# Altium schematic sheet Standby_PS.SchDoc
size A1; SPICEModelCacheYQEDCYZF: <root> / <DocumentId>YQEDCYZF</DocumentId> / <CacheFrame Number="0"> / <Model Name="7850_744775147_47u" Kind="CKT"> / <Text>******* / .subckt 7850_744775147_47u 1 2 / Rp 1 2 40000 / Cp 1 2 4p / Rs 1 N3 0.1343 / L1 N3 2 47u / .ends 7850_744775147_47u</Text> / </Model> / </CacheFrame> / </root>
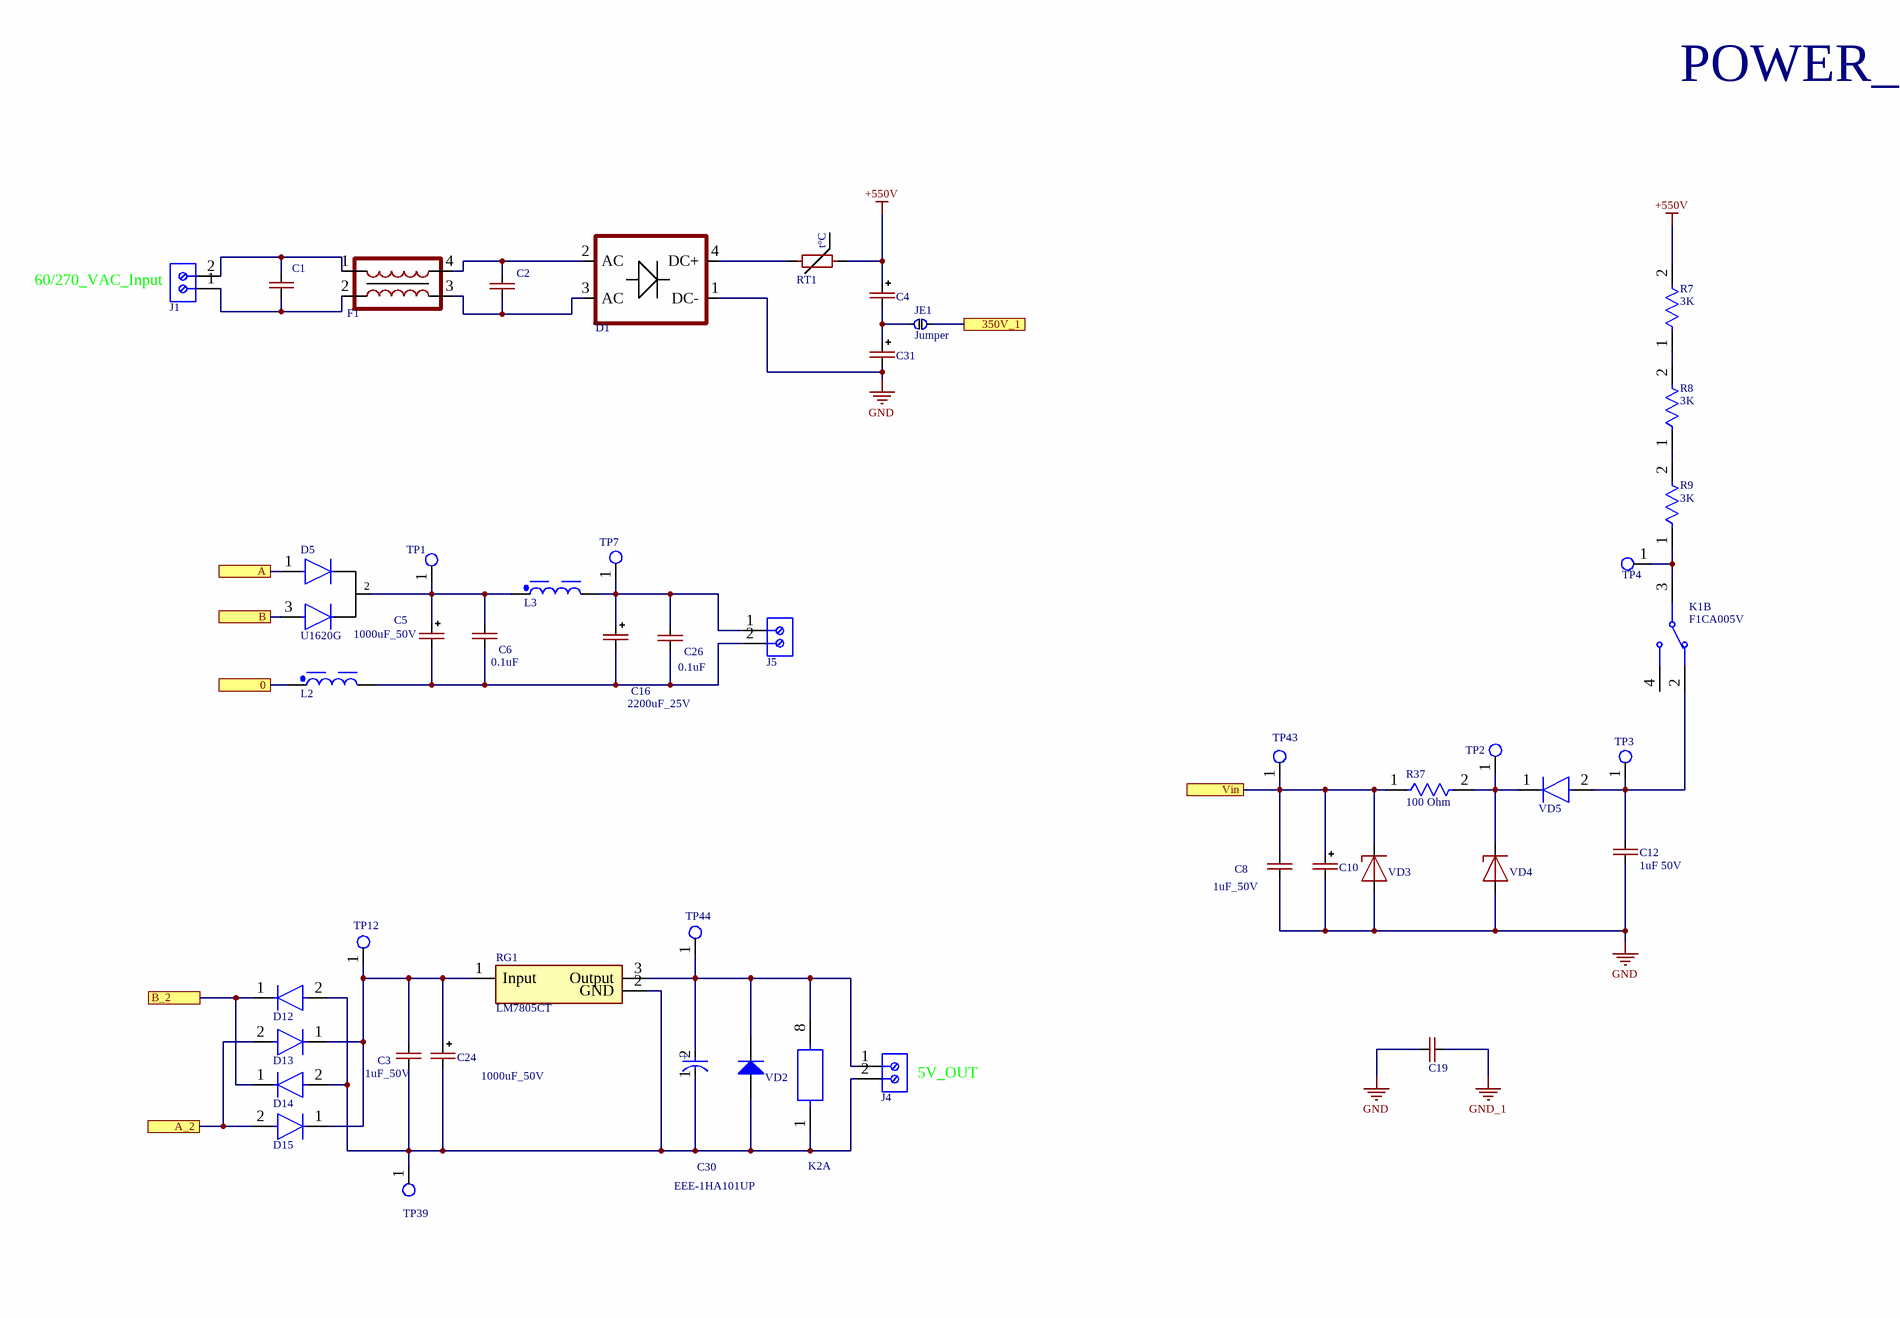
[diagram p0: Standby_PS.SchDoc, top left]
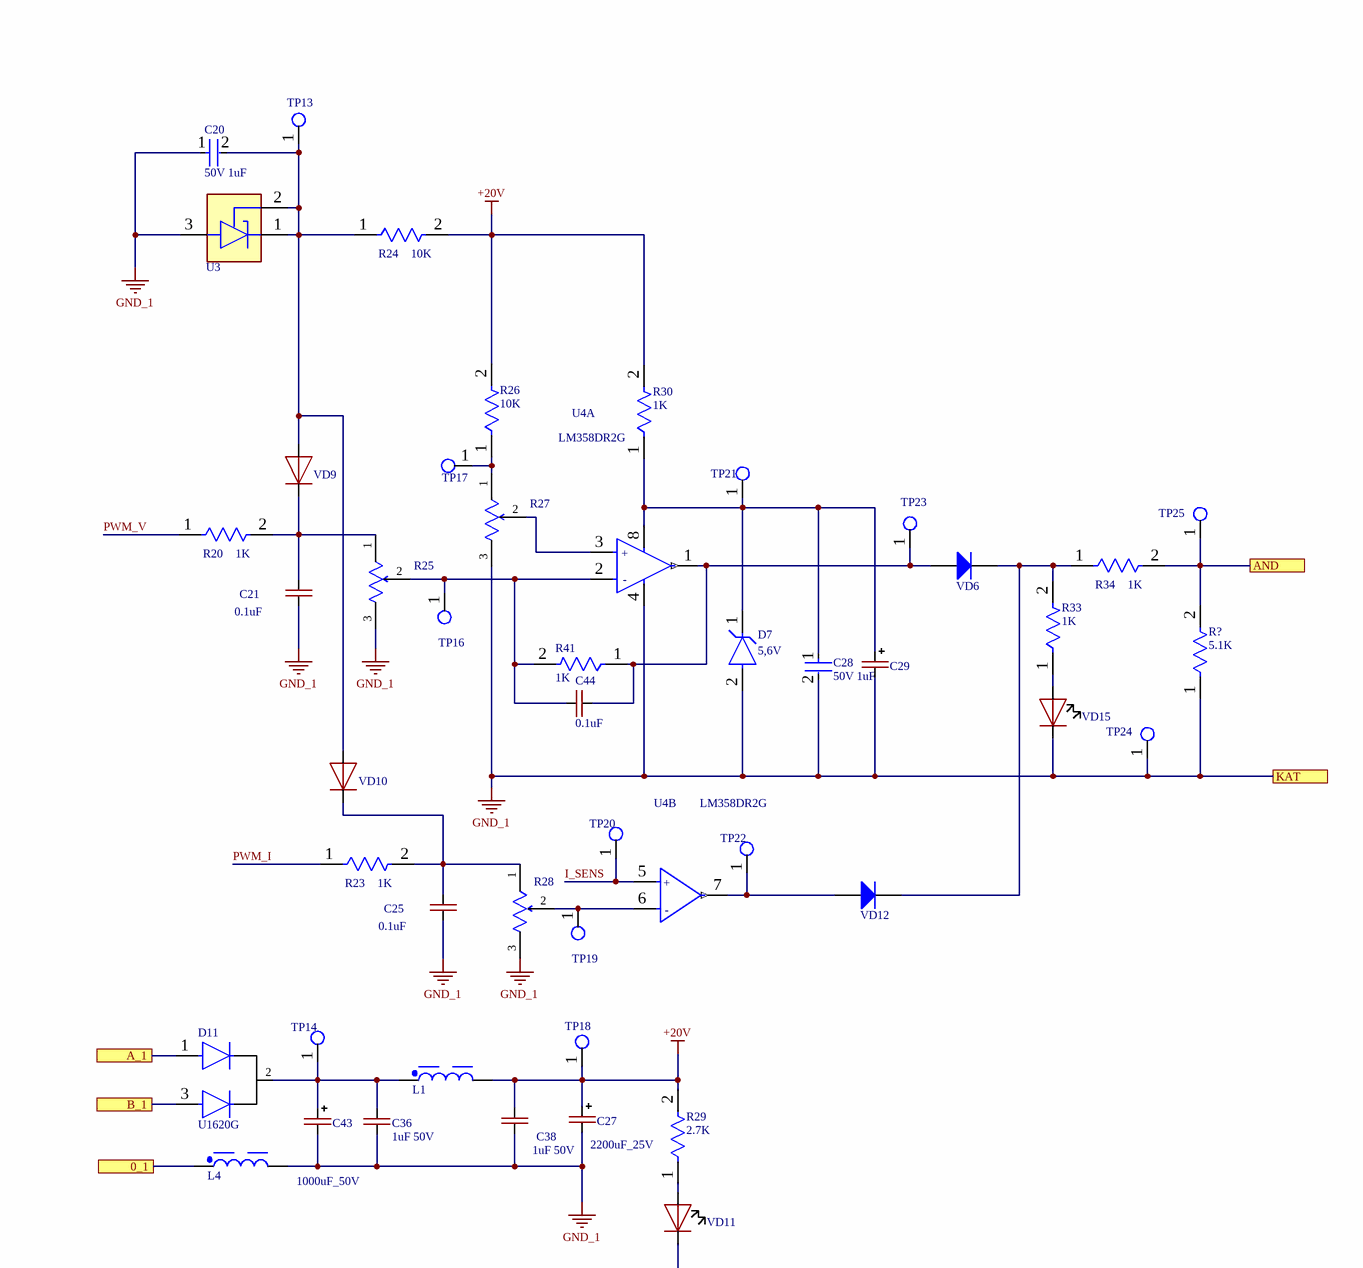
[diagram p1: Standby_PS.SchDoc, top right]
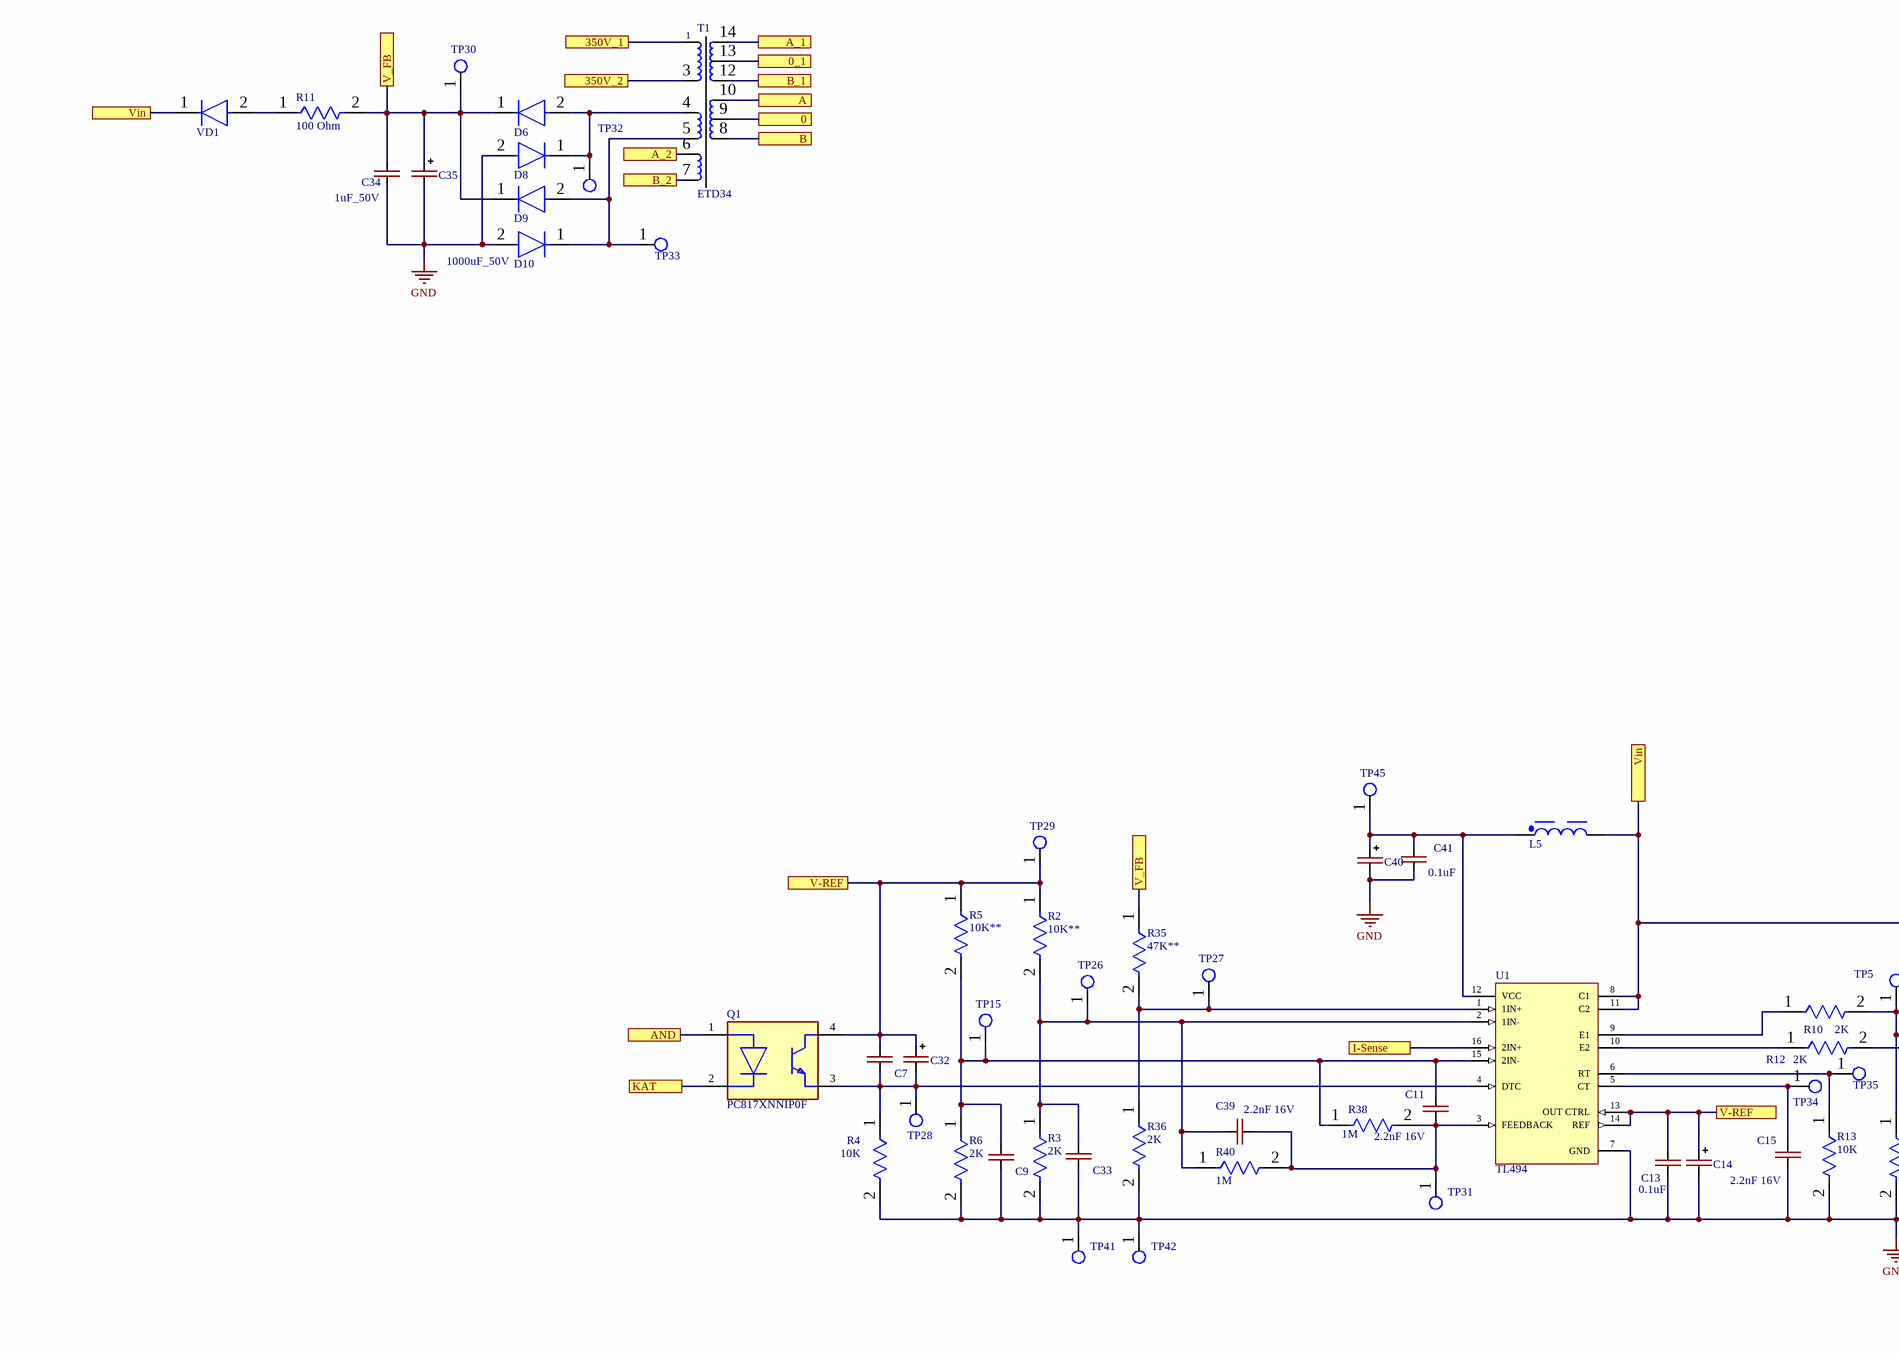
[diagram p2: Standby_PS.SchDoc, bottom left]
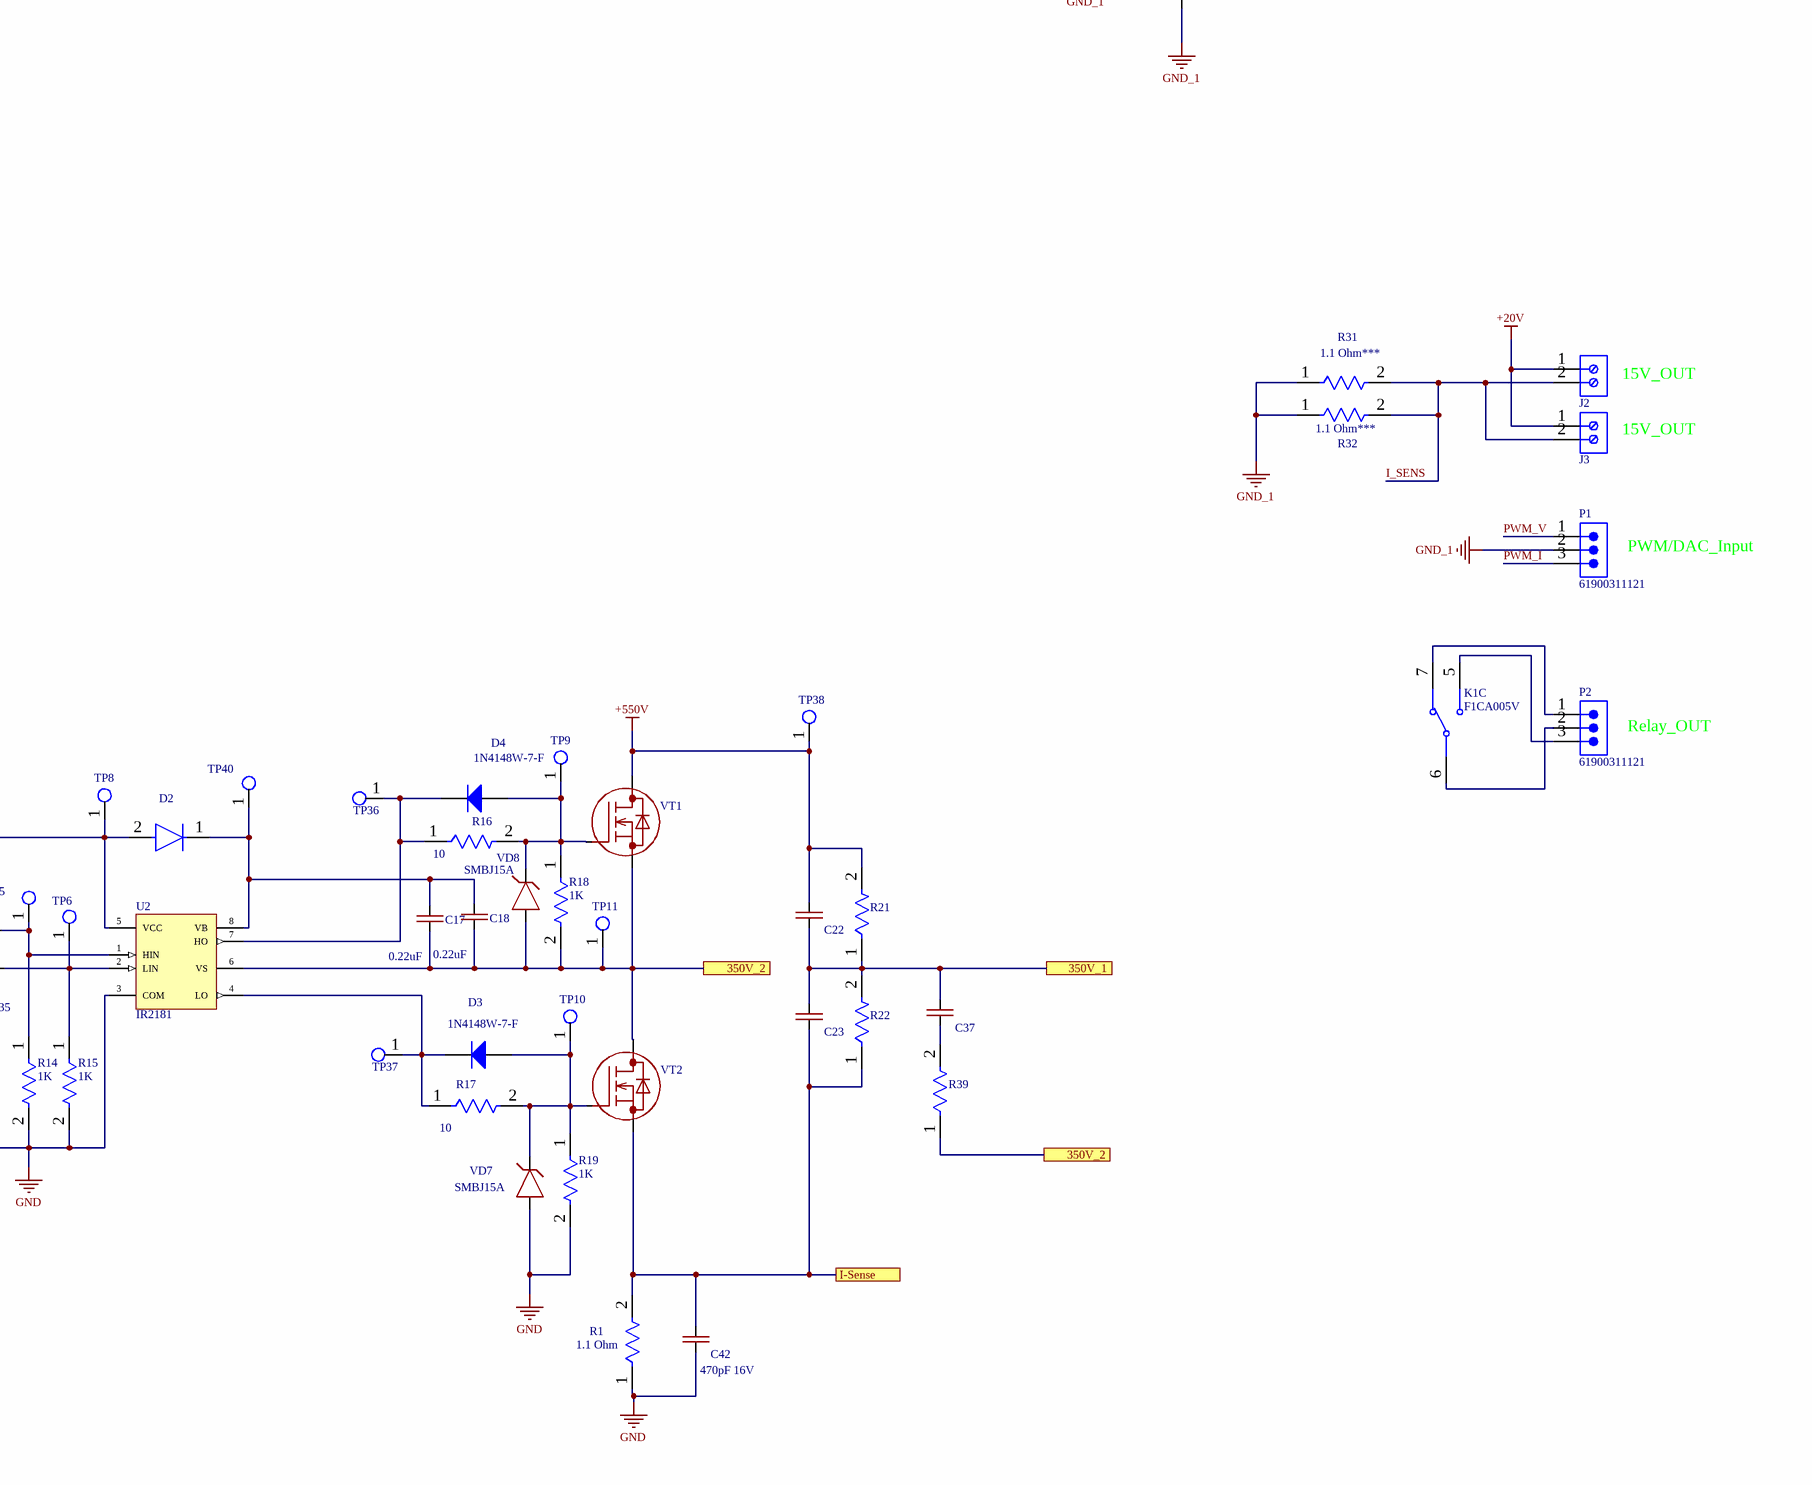
[diagram p3: Standby_PS.SchDoc, bottom right]

## Parts
C1  CAP-NON-POLAR  [CAP-V15]  (value not drawn)
C2  CAP-NON-POLAR  [CAP-V15]  (value not drawn)
C3  1uF_50V  [CAP-0805]
C4  CAP-POLAR  [CAP 100uF_500V 22x40mm]  (value not drawn)
C5  1000uF_50V  [CAPPOL-12x25]
C6  0.1uF  [CAP-0805]
C7  CAP-NON-POLAR  [CAP-0805]  (value not drawn)
C8  1uF_50V  [CAP-0805]
C9  CAP-NON-POLAR  [CAP-0805]  (value not drawn)
C10  CAP-POLAR  [CAPPOL-12x25]  (value not drawn)
C11  2.2nF 16V  [CAP-0805]
C12  1uF 50V  [CAP-0805]
C13  0.1uF  [CAP-0805]
C14  CAP-POLAR  [SIZE_EEE]  (value not drawn)
C15  2.2nF 16V  [CAP-0805]
C16  2200uF_25V  [CAPPOL-12x25]
C17  0.22uF  [FP-C1210X475K5RACTU-IPC_C]
C18  0.22uF  [FP-C1210X475K5RACTU-IPC_C]
C19  (no value)  [CAP-V]
C20  50V 1uF  [FP-C0805C-DN-IPC_A]
C21  0.1uF  [CAP-0805]
C22  CAP-NON-POLAR  [CAP_3.3uF_630V]  (value not drawn)
C23  CAP-NON-POLAR  [CAP_3.3uF_630V]  (value not drawn)
C24  1000uF_50V  [CAPPOL-12x25]
C25  0.1uF  [CAP-0805]
C26  0.1uF  [CAP-0805]
C27  2200uF_25V  [CAPPOL-18x40]
C28  50V 1uF  [FP-C0805C-DN-IPC_A]
C29  CAP-POLAR  [CAP-TAN-C]  (value not drawn)
C30  EEE-1HA101UP  [FP-SF-MFG]
C31  CAP-POLAR  [CAP 100uF_500V 22x40mm]  (value not drawn)
C32  CAP-POLAR  [CAP-TAN-D]  (value not drawn)
C33  CAP-NON-POLAR  [CAP-0805]  (value not drawn)
C34  1uF_50V  [CAP-0805]
C35  1000uF_50V  [CAPPOL-12x25]
C36  1uF 50V  [CAP-0805]
C37  CAP-V  [CAP-V]  (value not drawn)
C38  1uF 50V  [CAP-0805]
C39  2.2nF 16V  [CAP-0805]
C40  1000uF_50V  [CAP_25V_2200uF]  (value not drawn)
C41  0.1uF  [CAP-0805]
C42  470pF 16V  [CAP-0805]
C43  1000uF_50V  [CAP_50V_2200uF]
C44  0.1uF  [CAP-0805]
D1  RS40X  [RS40X]  (value not drawn)
D2  US1G  [DO-214AA]  (value not drawn)
D3  1N4148W-7-F  [DIOD-SOD123-2_V]
D4  1N4148W-7-F  [DIOD-SOD123-2_V]
D5  U1620G  [TO-220_Bended_Rad]
D6  US1G  [DO-214AA]  (value not drawn)
D7  5,6V  [FP-SB-V-3906_04-031_4-MFG]
D8  US1G  [DO-214AA]  (value not drawn)
D9  US1G  [DO-214AA]  (value not drawn)
D10  US1G  [DO-214AA]  (value not drawn)
D11  U1620G  [TO-220_Bended_Rad]
D12  US1G  [DO-214AA]  (value not drawn)
D13  US1G  [DO-214AA]  (value not drawn)
D14  US1G  [DO-214AA]  (value not drawn)
D15  US1G  [DO-214AA]  (value not drawn)
F1  FILTER  [FILTER_1]  (value not drawn)
J1  691101710002  [691101710002]  (value not drawn)
J2  (no value)  [691101710002]
J3  691101710002  [691101710002]  (value not drawn)
J4  691101710002  [691101710002]  (value not drawn)
J5  691101710002  [691101710002]  (value not drawn)
JE1  Jumper  [JE]
K1  F1CA005V  [Relay_F1CA005V_Omron]  (parts B,C of 3)
K2  (no value)  [Relay_F1CA005V_Omron]  (part A of 3)
L1  1.2µH, 7.4A  [WE-PD2_1054]  (value not drawn)
L2  1.2µH, 7.4A  [WE-PD2_1054]  (value not drawn)
L3  1.2µH, 7.4A  [WE-PD2_1054]  (value not drawn)
L4  1.2µH, 7.4A  [WE-PD2_1054]  (value not drawn)
L5  47µH, 1.17A  [WE-PD2_7850]  (value not drawn)
P1  61900311121  [61900311121]
P2  61900311121  [61900311121]
Q1  PC817XNNIP0F  [FP-PC817XNNIP0F-MFG]
R1  1.1 Ohm  [RES-2W]
R2  10K**  [RES-0805]
R3  2K  [RES-0805]
R4  10K  [RES-0805]
R5  10K**  [RES-0805]
R6  2K  [RES-0805]
R7  3K  [RES-2512]
R8  3K  [RES-2512]
R9  3K  [RES-2512]
R10  2K  [RES-0805]
R11  100 Ohm  [RES-2W]
R12  2K  [RES-0805]
R13  10K  [RES-0805]
R14  1K  [RES-0805]
R15  1K  [RES-0805]
R16  10  [RES_SMD_1210_IPC_A]
R17  10  [RES_SMD_1210_IPC_A]
R18  1K  [RES-0805]
R19  1K  [RES-0805]
R20  1K  [RES-0805]
R21  RES_1210  [RES_SMD_1210_IPC_A]  (value not drawn)
R22  RES_1210  [RES_SMD_1210_IPC_A]  (value not drawn)
R23  1K  [RES-0805]
R24  10K  [RES-0805]
R25  3296W-1-202LF  [Bourns_3296W_MFG]  (value not drawn)
R26  10K  [RES-0805]
R27  3296W-1-202LF  [Bourns_3296W_MFG]  (value not drawn)
R28  3296W-1-202LF  [Bourns_3296W_MFG]  (value not drawn)
R29  2.7K  [RES-0805]
R30  1K  [RES-0805]
R31  1.1 Ohm***  [RES-2W_2]
R32  1.1 Ohm***  [RES-2W_2]
R33  1K  [RES-0805]
R34  1K  [RES-0805]
R35  47K**  [RES-0805]
R36  2K  [RES-0805]
R37  100 Ohm  [RES-2W]
R38  1M  [RES-0805]
R39  RES_1210  [RES_SMD_1210_IPC_A]  (value not drawn)
R40  1M  [RES-0805]
R41  1K  [RES-0805]
R?  5.1K  [RES-0805]
RG1  (no value)  [TO-220_Bended_Rad]
RT1  RES-TEMP  [RES-V5]  (value not drawn)
T1  ETD34  [Transformer_ETD34]
TP1  Test_Point_PCB  [Test_Point]  (value not drawn)
TP2  Test_Point_PCB  [Test_Point]  (value not drawn)
TP3  Test_Point_PCB  [Test_Point]  (value not drawn)
TP4  Test_Point_PCB  [Test_Point]  (value not drawn)
TP5  (no value)  [Test_Point]
TP6  (no value)  [Test_Point]
TP7  Test_Point_PCB  [Test_Point]  (value not drawn)
TP8  (no value)  [Test_Point]
TP9  (no value)  [Test_Point]
TP10  (no value)  [Test_Point]
TP11  (no value)  [Test_Point]
TP12  (no value)  [Test_Point]
TP13  Test_Point_PCB  [Test_Point]  (value not drawn)
TP14  Test_Point_PCB  [Test_Point]  (value not drawn)
TP15  (no value)  [Test_Point]
TP16  Test_Point_PCB  [Test_Point]  (value not drawn)
TP17  Test_Point_PCB  [Test_Point]  (value not drawn)
TP18  Test_Point_PCB  [Test_Point]  (value not drawn)
TP19  Test_Point_PCB  [Test_Point]  (value not drawn)
TP20  Test_Point_PCB  [Test_Point]  (value not drawn)
TP21  Test_Point_PCB  [Test_Point]  (value not drawn)
TP22  Test_Point_PCB  [Test_Point]  (value not drawn)
TP23  Test_Point_PCB  [Test_Point]  (value not drawn)
TP24  Test_Point_PCB  [Test_Point]  (value not drawn)
TP25  Test_Point_PCB  [Test_Point]  (value not drawn)
TP26  (no value)  [Test_Point]
TP27  (no value)  [Test_Point]
TP28  (no value)  [Test_Point]
TP29  (no value)  [Test_Point]
TP30  (no value)  [Test_Point]
TP31  (no value)  [Test_Point]
TP32  (no value)  [Test_Point]
TP33  (no value)  [Test_Point]
TP34  (no value)  [Test_Point]
TP35  (no value)  [Test_Point]
TP36  (no value)  [Test_Point]
TP37  (no value)  [Test_Point]
TP38  (no value)  [Test_Point]
TP39  (no value)  [Test_Point]
TP40  (no value)  [Test_Point]
TP41  (no value)  [Test_Point]
TP42  (no value)  [Test_Point]
TP43  (no value)  [Test_Point]
TP44  (no value)  [Test_Point]
TP45  (no value)  [Test_Point]
U1  TL494  [SOIC-16-M]
U2  IR2181  [SO8-150]
U3  (no value)  [TL431_SOT-23-3(A)]
U4  LM358DR2G  [FP-751-07-IPC_C]  (parts A,B of 2)
VD1  US1G  [US1G_SMA]  (value not drawn)
VD2  (no value)  [DIOD-SOD123-2_V]
VD3  ZENER  [DO-017AA]  (value not drawn)
VD4  ZENER  [DO-017AA]  (value not drawn)
VD5  US1G  [US1G_SMA]  (value not drawn)
VD6  (no value)  [DIOD-SOD123-2_V]
VD7  SMBJ15A  [DO-214AA]
VD8  SMBJ15A  [DO-214AA]
VD9  DIODE  [SOD-123]  (value not drawn)
VD10  DIODE  [SOD-123]  (value not drawn)
VD11  LED  [LED-0603]  (value not drawn)
VD12  (no value)  [DIOD-SOD123-2_V]
VD15  LED  [LED-0603]  (value not drawn)
VT1  (no value)  [TO-220_Bended_Rad]
VT2  (no value)  [TO-220_Bended_Rad]

## Ports
0, 0_1, 350V_1, 350V_2, A, A_1, A_2, AND, B, B_1, B_2, I-Sense, KAT, V-REF, V_FB, Vin

## Nets
+20V: C27.1(+) C38.2 J2.1 J3.1 L1.2 R24.2 R26.2 R29.2 R30.2 TP18.1(G9)
+550V: C4.1(+) C22.2 R7.2 R21.2 RT1.1 TP38.1(G9) VT1.2(D)
GND: C8.2 C9.1 C10.2(-) C12.1 C13.1 C14.2(-) C15.1 C19.1 C31.2(-) C33.1 C34.2 C35.2(-) C40.2(-) C41.1 C42.1 D1.1(DC-) D8.2(A) D10.2(A) R1.1 R3.2 R4.2 R6.2 R13.2 R14.2 R15.2 R19.2 R36.2 TP41.1(G9) TP42.1(G9) U1.7(GND) U2.3(COM) VD3.2(A) VD4.2(A) VD7.1(A)
GND_1: C19.2 C20.1 C21.1 C25.1 C27.2(-) C28.2 C29.2(-) C36.1 C38.1 C43.2(-) D7.2(A) L4.2 P1.2 Q1.2(C) R25.3(CW) R27.3(CW) R28.3(CW) R31.1 R32.1 R?.1 TP24.1(G9) U3.3(A) U4.4(VEE/GND) VD11.1(C) VD15.1(C) ; port KAT
0: L2.1 T1.9 ; port 0
0_1: L4.1 T1.13 ; port 0_1
350V_1: C22.1 C23.2 C37.2 JE1.1 R21.1 R22.2 T1.1 ; port 350V_1
350V_2: C17.1 C18.1 R18.2 R39.1 T1.3 TP11.1(G9) U2.6(VS) VD8.1(A) VT1.3(S) VT2.2(D) ; port 350V_2
A: D5.1(A) T1.10 ; port A
A_1: D11.1(A) T1.14 ; port A_1
A_2: D13.2(A) D15.2(A) T1.6 ; port A_2
AND: Q1.1(A) R34.2 R?.2 TP25.1(G9) ; port AND
B: D5.3(A) T1.8 ; port B
B_1: D11.3(A) T1.12 ; port B_1
B_2: D12.1(C) D14.1(C) T1.7 ; port B_2
I-Sense: C23.1 C42.2 R1.2 R22.1 U1.16(2IN+) VT2.3(S) ; port I-Sense
I_SENS: J2.2 J3.2 R31.2 R32.2 TP20.1(G9) U4.5(INPUT_B+)
PWM_I: P1.3 R23.1
PWM_V: P1.1 R20.1
V-REF: C7.2 C13.2 C14.1(+) C32.1(+) Q1.4(C) R2.1 R5.1 TP29.1(G9) U1.13(OUT_CTRL) U1.14(REF) ; port V-REF
V_FB: C34.1 C35.1(+) D6.1(C) D9.1(C) R11.2 R35.1 TP30.1(G9) ; port V_FB
Vin: C8.1 C10.1(+) D2.2(A) L5.2 R37.1 TP8.1(G9) TP43.1(G9) U1.8(C1) U1.11(C2) U2.5(VCC) VD1.1(C) VD3.1(C) ; port Vin
NetC1_1: C1.1 F1.2 J1.1
NetC1_2: C1.2 F1.1 J1.2
NetC2_1: C2.1 D1.3(AC) F1.3
NetC2_2: C2.2 D1.2(AC) F1.4
NetC3_1: C3.1 C24.1(+) D13.1(C) D15.1(C) RG1.1(Input) TP12.1(G9)
NetC3_2: C3.2 C24.2(-) C30.1(C) D12.2(A) D14.2(A) J4.2 K2.1 RG1.2(GND) TP39.1(G9) VD2.2(A)
NetC4_2: C4.2(-) C31.1(+) JE1.2
NetC5_1: C5.1(+) C6.2 D5.2(C) L3.1 TP1.1(G9)
NetC5_2: C5.2(-) C6.1 C16.2(-) C26.1 J5.2 L2.2
NetC7_1: C7.1 C32.2(-) Q1.3(E) R4.1 TP28.1(G9) U1.4(DTC)
NetC9_2: C9.2 C11.2 R5.2 R6.1 TP15.1(G9) U1.15(2IN-)
NetC11_1: C11.1 C39.1 R38.2 R40.2 TP31.1(G9) U1.3(FEEDBACK)
NetC12_2: C12.2 K1.2 TP3.1(G9) VD5.2(A)
NetC15_2: C15.2 TP34.1(G9) U1.5(CT)
NetC16_1: C16.1(+) C26.2 J5.1 L3.2 TP7.1(G9)
NetC17_2: C17.2 C18.2 D2.1(C) TP40.1(G9) U2.8(VB)
NetC20_2: C20.2 R24.1 TP13.1(G9) U3.1(C) U3.2(REF) VD9.2(A) VD10.2(A)
NetC21_2: C21.2 R20.2 R25.1(CCW) VD9.1(C)
NetC25_2: C25.2 R23.2 R28.1(CCW) VD10.1(C)
NetC28_1: C28.1 C29.1(+) D7.1(C) R30.1 TP21.1(G9) U4.8(VCC)
NetC30_2: C30.2(A) J4.1 K2.8 RG1.3(Output) TP44.1(G9) VD2.1(K)
NetC33_2: C33.2 C39.2 R2.2 R3.1 R40.1 TP26.1(G9) U1.2(1IN-)
NetC36_2: C36.2 C43.1(+) D11.2(C) L1.1 TP14.1(G9)
NetC37_1: C37.1 R39.2
NetC40_1: C40.1(+) C41.2 L5.1 TP45.1(G9) U1.12(VCC)
NetC44_1: C44.1 R41.1 TP23.1(G9) U4.1(OUTPUT_A) VD6.2(A)
NetC44_2: C44.2 R25.2(WIPER) R41.2 TP16.1(G9) U4.2(INPUT_A-)
NetD1_4: D1.4(DC+) RT1.2
NetD3_1: D3.1(K) R17.1 TP37.1(G9) U2.4(LO)
NetD3_2: D3.2(A) R17.2 R19.1 TP10.1(G9) VD7.2(C) VT2.1(G)
NetD4_1: D4.1(K) R16.1 TP36.1(G9) U2.7(HO)
NetD4_2: D4.2(A) R16.2 R18.1 TP9.1(G9) VD8.2(C) VT1.1(G)
NetD6_2: D6.2(A) D8.1(C) T1.4 TP32.1(G9)
NetD9_2: D9.2(A) D10.1(C) T1.5 TP33.1(G9)
NetK1_3: K1.3 R9.1 TP4.1(G9)
NetK1_5: K1.5 P2.3
NetK1_6: K1.6 P2.2
NetK1_7: K1.7 P2.1
NetR7_1: R7.1 R8.2
NetR8_1: R8.1 R9.2
NetR10_1: R10.1 U1.9(E1)
NetR10_2: R10.2 R14.1 TP5.1(G9) U2.1(HIN)
NetR11_1: R11.1 VD1.2(A)
NetR12_1: R12.1 U1.10(E2)
NetR12_2: R12.2 R15.1 TP6.1(G9) U2.2(LIN)
NetR13_1: R13.1 TP35.1(G9) U1.6(RT)
NetR26_1: R26.1 R27.1(CCW) TP17.1(G9)
NetR27_2: R27.2(WIPER) U4.3(INPUT_A+)
NetR28_2: R28.2(WIPER) TP19.1(G9) U4.6(INPUT_B-)
NetR29_1: R29.1 VD11.2(A)
NetR33_1: R33.1 VD15.2(A)
NetR33_2: R33.2 R34.1 VD6.1(K) VD12.1(K)
NetR35_2: R35.2 R36.1 TP27.1(G9) U1.1(1IN+)
NetR37_2: R37.2 TP2.1(G9) VD4.1(C) VD5.1(C)
NetTP22_1: TP22.1(G9) U4.7(OUTPUT_B) VD12.2(A)

Not connected (* = marked no-connect by the designer): K1 4; R38 1

## Notes on the sheet
- POWER_SUPPLY 60-350V/16V-4A
- (near J1) 60/270_VAC_Input
- (near J4) 5V_OUT
- 15V_OUT
- (near P1) PWM/DAC_Input
- (near P2) Relay_OUT
- (in symbol CMP-1310-00291-2, part A) +; -
- (in symbol CMP-1310-00291-2, part B) +; -
- (in symbol CMP-05427-000015-1) +
- (in symbol RES-TEMP) t°C

## Library data of the parts
C3 C6 C8 C11-C13 C15 C21 C25 C26 C34 C36 C38 C39 C41 C42 C44 = CAP-NON-POLAR
C5 C16 C27 = CAP-POLAR
C17 C18 = CAP_1210
C19 = CAP-V
C20 C28 = CMP-1036-04552-2: CAP CER 0.22UF 50V X7R 0805; Manufacturer: KEMET; Manufacturer Part Number: C0805C224K5RACTU; Value: 0.22 μF; Temperature Coefficient: 30ppm/°C; Material: Ceramic; Tolerance: 0.1; ComponentLink2URL: https://content.kemet.com/datasheets/KEM_C1003_C0G_SMD.pdf; Temperature Characteristic: X7R; Device Class L3: Ceramic Capacitors; Lead Free: Yes; Temperature: -55°C to +125°C; RoHS: TRUE; Capacitance: 0.22 μF; Automotive: No; Octopart: https://octopart.com/c0805c224k5ractu-kemet-144670; Temperature Range Low: -55°C; Height: 0.88mm; Device Class L1: Passive Components; Digikey Description: CAP CER 0.22UF 50V X7R 0805; ComponentLink2Description: Datasheet; Mouser Description: CAP CER 0.22UF 50V X7R 0805; Category: Cap; Ipc Land Pattern Name: CAPC200125X78; Temperature Range High: +125°C; Package: C0805C-DN; Device Class L2: Capacitors; Voltage Rating: 50 V
C24 C35 = CAP-POLAR: 1000uF_50V  12x25(13x26mm)
C30 = CMP-05427-000015-1: CAP ALUM 100UF 20% 50V SMD; Manufacturer: Panasonic; Automotive Grade: Grade 3; Leakage Current: 100uA; Dissipation Factor: 0.12%; Life: 2000Hours; Ripple Current: 200mA; Material: Aluminum; ComponentLink2Description: Datasheet; Category: Cap; Voltage Rating: 50V; Value: 100uF; Octopart: https://octopart.com/eee-1ha101up-panasonic-55396734; Digikey Description: CAP ALUM 100UF 20% 50V SMD; Package: SF; RoHS: TRUE; Height: 10.5mm; ComponentLink2URL: https://industrial.panasonic.com/cdbs/www-data/pdf/RDE0000/ABA0000C1145.pdf; Tolerance: 20%; Mouser Description: Cap Aluminum Lytic 100uF 50V 20% (8 X 10.2mm) SMD 200mA 2000h 85C Automotive T/R; Device Class L2: Capacitors; Temperature Range High: +85°C; Lead Free: Yes; Device Class L3: Aluminum Electrolytic Capacitors; Device Class L1: Passive Components; Manufacturer Part Number: EEE-1HA101UP; Temperature: -40°C to +85°C; Automotive: Yes; Capacitance: 100uF; Voltage: 50V; Temperature Range Low: -40°C
C40 C43 = CAP_polar_Hitano
D3 D4 VD2 VD6 VD12 = 1N4148: Fast Switching Diode, 100 V, 0.15 A, -65 to 150 degC, 2-Pin?SOD123, RoHS, Tape and Reel; Recovery Time: 4ns; Brand: DiodesIncorporated; Unit Weight: 0.000353oz; Max Surge Current: 2A; Peak Reverse Voltage: 100V; Ir - Reverse Current: 1uA; Vf - Forward Voltage: 1.25V; Configuration: Single; If - Forward Current: 0.15A; Product Category: Diodes-GeneralPurpose,Power,Switching; Operating Temperature Range: -65Cto+150C; Packaging: Reel; Manufacturer URL: http://www.diodes.com/; Maximum Operating Temperature: +150C; Height: 1.25mm; Minimum Operating Temperature: -65C; Product: SwitchingDiodes; Package URL: http://www.diodes.com/datasheets/ds18004.pdf; Type: SwitchingDiode; Package Reference: SOD123-2; Width: 1.7mm; Datasheet URL: http://www.farnell.com/datasheets/1915529.pdf; Datasheet Version: Rev. 24-2, 10/2013; Series: 1N4148; Factory Pack Quantity: 3000; Length: 2.85mm; RoHS: True; Manufacturer: DiodesIncorporated; Mounting Style: SMD/SMT; Package / Case: SOD-123
D7 = CMP-02541-000026-1: DIODE ZENER 8.2V 500MW DO35; Test Current: 5mA; Tolerance: 2%; Impedance: 7R; ESD Protection: No; Element Configuration: Single; Max Reverse Leakage Current: 100nA; Packaging: Ammo Pack; Case/Package: DO-35; Lead Free: Lead Free; Number of Pins: 2; Min Operating Temperature: -65°C; Contact Plating: Tin; Max Power Dissipation: 500mW; Radiation Hardening: No; Max Operating Temperature: 175°C; Mount: Through Hole; Package Quantity: 30000; Voltage Tolerance: 2%; Series: Automotive, AEC-Q101; Zener Voltage: 8.2V; RoHS Compliant: Yes; Power Dissipation: 500mW
J1-J5 = 691101710002: WR-TBL Series 101 Horizontal Entry Modular, THT, pitch 5mm, 2p; Manufacturer: Wurth Elektronik; Modularity: Yes; Rated Current: 16A; Working Voltage: 250V; ComponentLink1Description: Website Link; ComponentLink1URL: https://www.we-online.com/redexpert/article/691101710002?ad; ComponentLink2Description: Datasheet Link; ComponentLink2URL: https://www.we-online.com/redexpert/spec/691101710002?ad; Manufacturer Part Number: 691101710002; Category: Terminal Blocks; Match Code: WR-TBL; Mount: Through Hole; Operating Temperature Max: 105°C; Operating Temperature Min: -40°C; Packaging: Box; Application: Pressure Clamp; Number of Pins: 2; Number of Rows: 1; Orientation: Horizontal; Pitch: 5mm
JE1 = JE
K2 = F1CA005V
L1-L4 = 744776012: WE-PD2 SMT Power Inductor, size 1054, 1.2µH, 7.4A, 0.006Ω; Manufacturer: Wurth Elektronik; Case/Size Code: 1054; DC Resistance: 0.004Ω; Saturation Current: 11A; Self Resonant Frequency: 110MHz; Manufacturer Part Number: 744776012; Category: Unshielded Power Inductors; Match Code: WE-PD2; ComponentLink1Description: Website Link; ComponentLink1URL: https://www.we-online.com/redexpert/article/744776012?ad; ComponentLink2Description: Datasheet Link; ComponentLink2URL: https://www.we-online.com/redexpert/spec/744776012?ad; Mount: Surface Mount; Operating Temperature Max: 125°C; Operating Temperature Min: -40°C; Packaging: Tape and Reel; Length: 10mm; Width: 9mm; Height: 5.4mm; DC Resistance Max: 0.006Ω; Inductance: 1.2µH; Rated Current: 7.4A
L5 = 744775147: WE-PD2 SMT Power Inductor, size 7850, 47µH, 1.17A, 0.18Ω; Manufacturer: Wurth Elektronik; Case/Size Code: 7850; DC Resistance: 0.134Ω; Saturation Current: 1.24A; Self Resonant Frequency: 12MHz; Manufacturer Part Number: 744775147; Category: Unshielded Power Inductors; Match Code: WE-PD2; ComponentLink1Description: Website Link; ComponentLink1URL: https://www.we-online.com/redexpert/article/744775147?ad; ComponentLink2Description: Datasheet Link; ComponentLink2URL: https://www.we-online.com/redexpert/spec/744775147?ad; Mount: Surface Mount; Operating Temperature Max: 125°C; Operating Temperature Min: -40°C; Packaging: Tape and Reel; Length: 7.8mm; Width: 7mm; Height: 4.95mm; DC Resistance Max: 0.18Ω; Inductance: 47µH; Rated Current: 1.17A
P1 P2 = 61900311121: WR-WTB THT Male Vertical Locking Header, pitch 2.54mm, 3pins; Manufacturer: Wurth Elektronik; Contact Resistance: 20mΩ; Rated Current: 3A; Withstanding Voltage: 1000VAC; Working Voltage: 250VAC; ComponentLink1Description: Website Link; ComponentLink1URL: https://www.we-online.com/redexpert/article/61900311121?ad; ComponentLink2Description: Datasheet Link; ComponentLink2URL: https://www.we-online.com/redexpert/spec/61900311121?ad; Pitch: 2.54mm; Packaging: Bag; Gender: Male; Manufacturer Part Number: 61900311121; Category: Wire-to-Board Connectors; Match Code: WR-WTB; Mount: Through Hole; Operating Temperature Max: 105°C; Operating Temperature Min: -40°C; Length: 7.62mm; Width: 5.8mm; Height: 11.5mm; Number of Pins: 3; Number of Rows: 1; Orientation: Vertical
Q1 = PC817_SMD: OPTOISOLATOR 5KV TRANS 4SMD; Reverse Breakdown Voltage: 6V; Output Current per Channel: 30mA; Power Dissipation: 200mW; Collector-emitter Voltage-Max: 200mV; Max Output Voltage: 80V; Input Current: 50mA; Forward Voltage: 1.4V; Fall Time: 18000ns; Number of Elements: 1; Input Type: DC; Packaging: Tape and Reel; RoHS Compliant: Yes; Contact Plating: Copper; Min Operating Temperature: -30°C; Collector Emitter Saturation Voltage: 200mV; Max Input Current: 50mA; Radiation Hardening: No; Max Collector Current: 50mA; Case/Package: SMD/SMT; Mount: Surface Mount; Output Voltage: 80V; Forward Current: 50mA; Max Power Dissipation: 200mW; Collector Emitter Voltage (VCEO): 80V; Number of Channels: 1; Rise Time: 18000ns; Isolation Voltage: 5kV; Number of Pins: 4; Lead Free: Lead Free; Package Quantity: 2000; Isolation Voltage-Max: 5kV; Max Operating Temperature: 100°C
R1 R3 R4 R6-R15 R18-R20 R23 R24 R29 R30 R33 R34 R36-R38 R40 R41 R? = RES-CONST
R2 R5 R31 R32 = RES-CONST: 10K
R16 R17 = RES_1210
R26 = RES-CONST: 1-K
R35 = RES-CONST: 47K
RG1 = LM7805CT: REG IC REG LINEAR 5V 1A TO220AB; Manufacturer: Fairchild; Voltage Dropout (Max): 2V @ 1A (Typ); Voltage - Input (Max): 35V; helpURL: https://upverter.com/upn/revision/b27a7358b7dd93a3/; ComponentLink2Description: Datasheet; Temperature: -40°C to +125°C; Package: TO220; Supplier 2: Mouser; Price: 0.384521982769; Supplier 1: Digi-Key; ComponentLink1URL: https://upverter.com/upn/revision/b27a7358b7dd93a3/; Supplier Part Number 2: 512-LM7805CT; Supplier Part Number 1: LM7805CT-ND; ComponentLink1Description: Upverter; ComponentLink2URL: https://www.fairchildsemi.com/datasheets/LM/LM7805.pdf; RoHS: TRUE; Mouser Part Number: 512-LM7805CT; Ipc Land Pattern Name: TO-220; Temperature Range High: +125°C; Digikey Description: REG IC REG LINEAR 5V 1A TO220AB; Digikey Part Number: LM7805CT-ND; Lead Free: yes; Temperature Range Low: -40°C; Voltage - Output: 5V; Current-Output: 1A; Part Number: LM7805CT
TP1-TP45 = TP_PCB?: Test_Point
U1 = TL494: TL494 Pwm controller
U2 = IR2181: IR2181 Driver
U3 = TL431_SOT-23-3
U4 = CMP-1310-00291-2: IC OPAMP GP 2 CIRCUIT 8SOIC; Gain Bandwidth Product: 1MHz; Number of Circuits: 2; Min Supply Voltage: 3V; Slew Rate: 0.6V/µs; Max Dual Supply Voltage: 16V; Common Mode Rejection Ratio: 65dB; Input Bias Current: 250nA; Min Dual Supply Voltage: 1.5V; Dual Supply Voltage: 9V; Operating Supply Current: 1.5mA; Output Current: 40mA; Input Offset Voltage (Vos): 7mV; Nominal Supply Current: 1.2mA; Voltage Gain: 100dB; Max Supply Voltage: 32V; Width: 4mm; Number of Pins: 8; Min Operating Temperature: 0°C; REACH SVHC: No SVHC; Contact Plating: Tin; Lead Free: Lead Free; Halogen Free: Halogen Free; Power Supply Rejection Ratio (PSRR): 65dB; Operating Supply Voltage: 16V; Package Quantity: 2500; Max Operating Temperature: 70°C; Case/Package: SOIC; Height: 1.5mm; Packaging: Tape and Reel; Radiation Hardening: No; Number of Channels: 2; Bandwidth: 1MHz; Length: 5mm; Number of Elements: 2; Number of Amplifiers: 2; Output Current per Channel: 40mA
VT1 VT2 = MOSFET-N-GDS